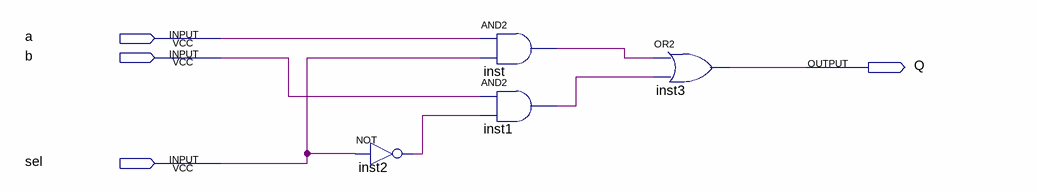
[diagram p0: schematic sheet]
// Quartus schematic MyMUX.bdf as structural Verilog: 4 symbols, 4 pins
module MyMUX (
  input  a,
  input  b,
  input  sel,
  output Q
);

  wire inst1_out, inst2_out, inst_out;

  not inst2 (inst2_out, sel);
  and inst (inst_out, a, sel);
  and inst1 (inst1_out, b, inst2_out);
  or inst3 (Q, inst_out, inst1_out);
endmodule
